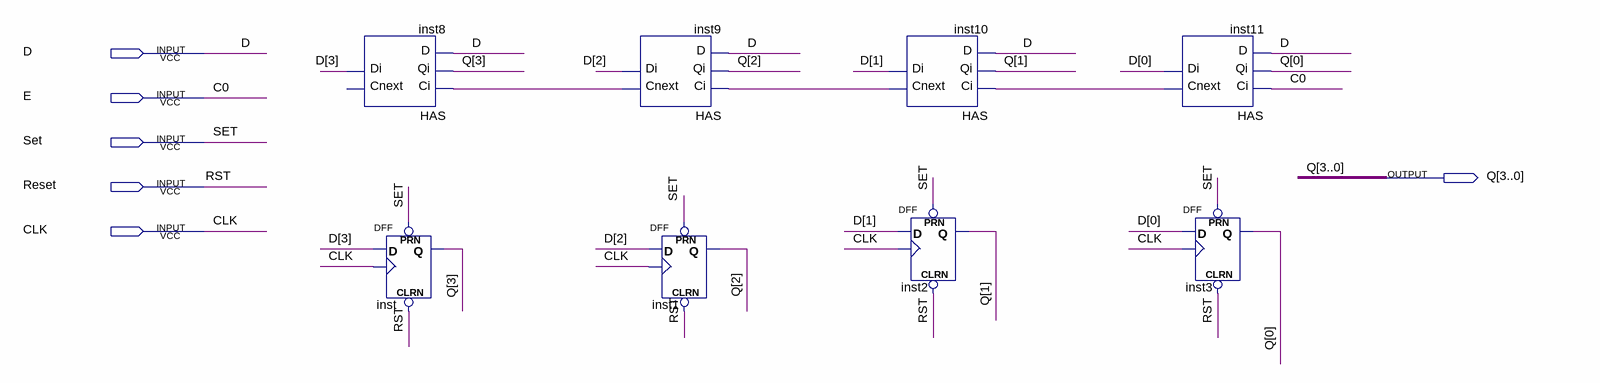
[diagram p0: schematic sheet]
// Quartus schematic CounterUp_Down.bdf as structural Verilog: 8 symbols, 6 pins
module CounterUp_Down (
  input  D,
  input  E,
  input  Set,
  input  Reset,
  input  CLK,
  output [3:0] Q
);

  wire inst9_cnext, inst10_cnext, inst11_cnext;
  wire [3:0] D_bus;

  HAS inst8 (.D(D), .Qi(Q[3]), .Ci(inst9_cnext), .Di(D_bus[3]));  // open: Cnext
  DFF inst (.CLRN(Reset), .CLK(CLK), .D(D_bus[3]), .PRN(Set), .Q(Q[3]));
  HAS inst9 (.D(D), .Qi(Q[2]), .Ci(inst10_cnext), .Cnext(inst9_cnext), .Di(D_bus[2]));
  DFF inst1 (.CLRN(Reset), .CLK(CLK), .D(D_bus[2]), .PRN(Set), .Q(Q[2]));
  HAS inst10 (.D(D), .Qi(Q[1]), .Ci(inst11_cnext), .Cnext(inst10_cnext), .Di(D_bus[1]));
  DFF inst2 (.CLRN(Reset), .CLK(CLK), .D(D_bus[1]), .PRN(Set), .Q(Q[1]));
  HAS inst11 (.D(D), .Qi(Q[0]), .Ci(E), .Cnext(inst11_cnext), .Di(D_bus[0]));
  DFF inst3 (.CLRN(Reset), .CLK(CLK), .D(D_bus[0]), .PRN(Set), .Q(Q[0]));

  // Other names for the same wires on the sheet: C0 = E; RST = Reset
endmodule
